# Altium project BLDC_Sch.PrjPcb
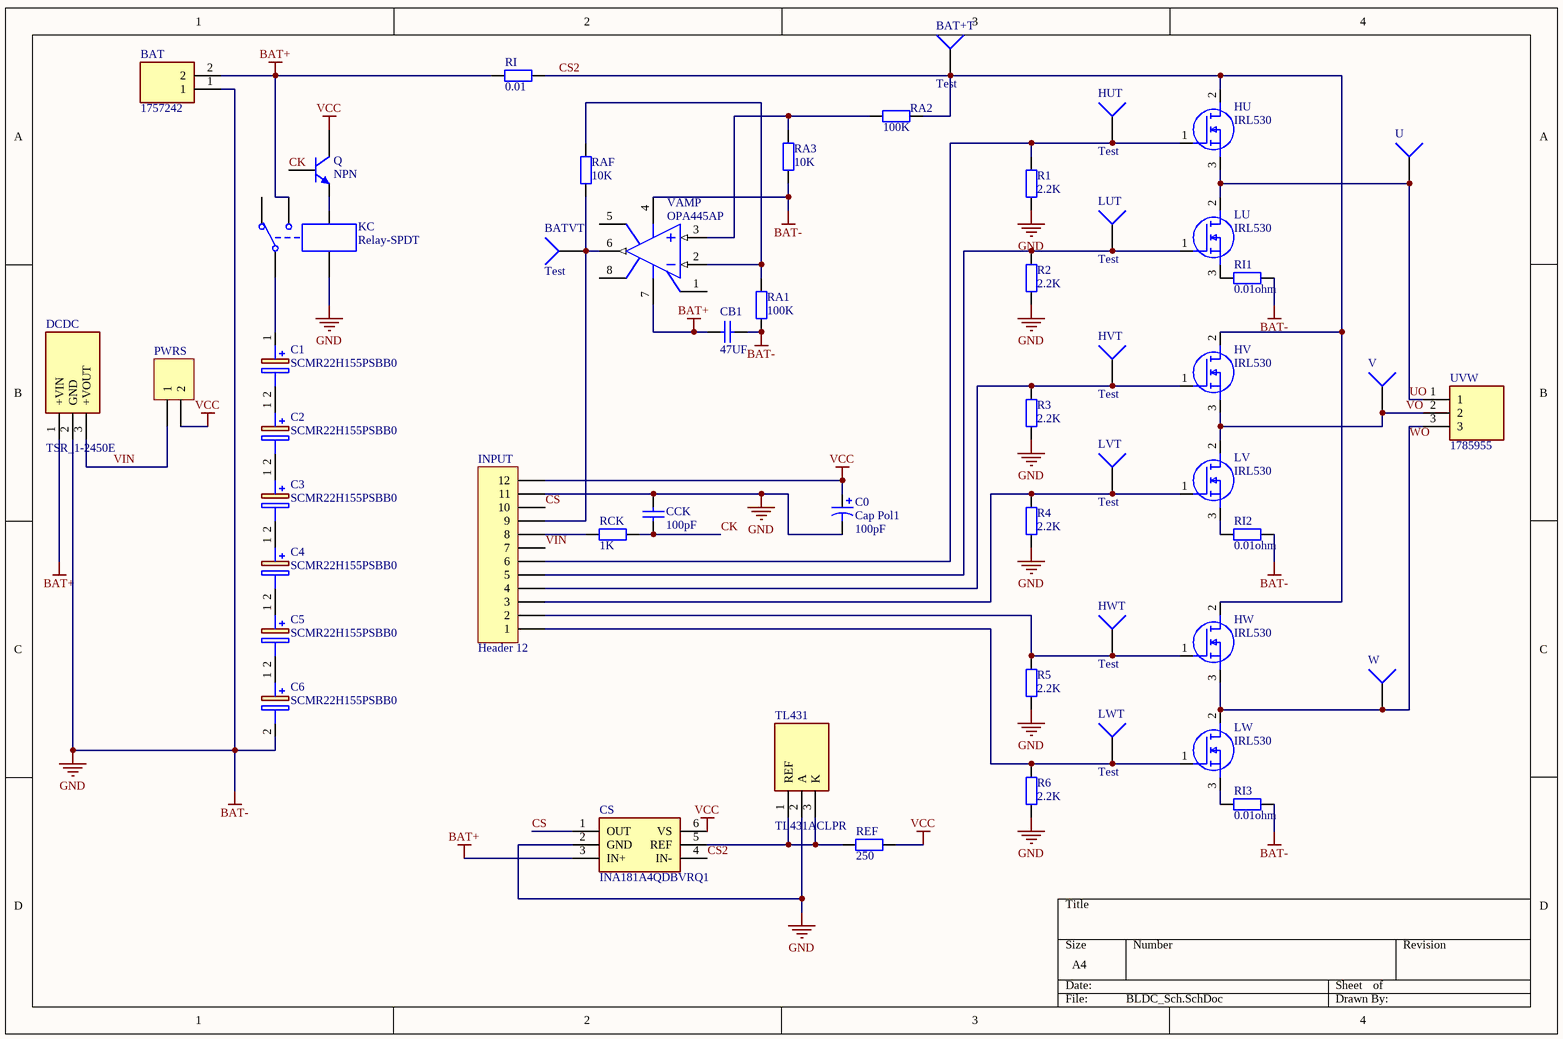
[diagram p0: BLDC_Sch.SchDoc]
1 sheet, 52 parts. Net scope: global (net labels, ports and power ports of the same name join across sheets).
Board files: BLDC_PCB.PcbDoc, BLDC_PCB_V2.PcbDoc, BLDC_PCB_V2.1.PcbDoc, BLDC_PCBV3.PcbDoc

## Sheet BLDC_Sch.SchDoc
size A4

### Parts
BAT  1757242  [SHDR2W100P0X508_1X2_1016X860X1250P]
BAT+T  Test  [PIN1]
BATVT  Test  [PIN1]
C0  Cap Pol1  value 100pF  [CAP 5.0*10*12.5]
C1  SCMR22H155PSBB0  [SCMR22H155PSBB0]
C2  SCMR22H155PSBB0  [SCMR22H155PSBB0]
C3  SCMR22H155PSBB0  [SCMR22H155PSBB0]
C4  SCMR22H155PSBB0  [SCMR22H155PSBB0]
C5  SCMR22H155PSBB0  [SCMR22H155PSBB0]
C6  SCMR22H155PSBB0  [SCMR22H155PSBB0]
CB1  value 47UF  [CBB 6.3*6.3*5]  (hidden comment: Cap)
CCK  value 100pF  [CBB 6.3*6.3*5]  (hidden comment: Cap)
CS  INA181A4QDBVRQ1  [SOT95P280X145-6N]
DCDC  TSR_1-2450E  [TSR12450E]
HU  IRL530  [TO254P465X1024X2050-3P]
HUT  Test  [PIN1]
HV  IRL530  [TO254P465X1024X2050-3P]
HVT  Test  [PIN1]
HW  IRL530  [TO254P465X1024X2050-3P]
HWT  Test  [PIN1]
INPUT  Header 12  [HDR1X12]
KC  Relay-SPDT  [SRD-C_BK]
LU  IRL530  [TO254P465X1024X2050-3P]
LUT  Test  [PIN1]
LV  IRL530  [TO254P465X1024X2050-3P]
LVT  Test  [PIN1]
LW  IRL530  [TO254P465X1024X2050-3P]
LWT  Test  [PIN1]
PWRS  Header 2  [HDR1X2]  (value not drawn)
Q  NPN  [TO-226-AA]
R1  value 2.2K  [RS 1/4W]  (hidden comment: Res2)
R2  value 2.2K  [RS 1/4W]  (hidden comment: Res2)
R3  value 2.2K  [RS 1/4W]  (hidden comment: Res2)
R4  value 2.2K  [RS 1/4W]  (hidden comment: Res2)
R5  value 2.2K  [RS 1/4W]  (hidden comment: Res2)
R6  value 2.2K  [RS 1/4W]  (hidden comment: Res2)
RA1  value 100K  [RS 1/4W]  (hidden comment: Res2)
RA2  value 100K  [RS 1/4W]  (hidden comment: Res2)
RA3  value 10K  [RS 1/4W]  (hidden comment: Res2)
RAF  value 10K  [RS 1/4W]  (hidden comment: Res2)
RCK  value 1K  [RS 1/4W]  (hidden comment: Res2)
REF  value 250  [RS 1/4W]  (hidden comment: Res2)
RI  value 0.01  [R 2512]  (hidden comment: Res2)
RI1  value 0.01ohm  [R 2512]  (hidden comment: Res2)
RI2  value 0.01ohm  [R 2512]  (hidden comment: Res2)
RI3  value 0.01ohm  [R 2512]  (hidden comment: Res2)
TL431  TL431ACLPR  [TL431ACLPR]
U  2376595-2  [23765952]  (value not drawn)
UVW  1785955  [SHDRRA3W103P0X508_1X3_1524X1200X872P]
V  2376595-2  [23765952]  (value not drawn)
VAMP  OPA445AP  [DIP794W53P254L959H508Q8N]
W  2376595-2  [23765952]  (value not drawn)

### Nets
BAT+: BAT.2 CB1.1 CS.3(IN+) DCDC.1(+VIN) KC.3 RI.1 VAMP.7(V+)
BAT-: BAT.1 C0.2 C6.2(-) CB1.2 CCK.2 CS.2(GND) DCDC.2(GND) INPUT.11 KC.4 R1.1 R2.1 R3.1 R4.2 R5.2 R6.2 RA1.2 RA3.1 RI1.2 RI2.2 RI3.2 TL431.2(A) VAMP.4(V-)  [also labelled GND]
VCC: C0.1 CS.6(VS) INPUT.12 PWRS.2 Q.1(C) REF.2
CK: CCK.1 Q.2(B) RCK.2
CS: CS.1(OUT) INPUT.10
CS2: BAT+T.1 CS.4(IN-) HU.2(D) HV.2(D) HW.2(D) RA2.2 RI.2
UO: HU.3(S) LU.2(D) U.1 UVW.1
VIN: DCDC.3(+VOUT) INPUT.7 PWRS.1
VO: HV.3(S) LV.2(D) UVW.2 V.1
WO: HW.3(S) LW.2(D) UVW.3 W.1
NetBATVT_1: BATVT.1 INPUT.9 RAF.1 VAMP.6(OUT)
NetC1_1: C1.1(+) KC.1
NetC1_2: C1.2(-) C2.1(+)
NetC2_2: C2.2(-) C3.1(+)
NetC3_2: C3.2(-) C4.1(+)
NetC4_2: C4.2(-) C5.1(+)
NetC5_2: C5.2(-) C6.1(+)
NetCS_5: CS.5(REF) REF.1 TL431.1(REF) TL431.3(K)
NetHU_1: HU.1(G) HUT.1 INPUT.6 R1.2
NetHV_1: HV.1(G) HVT.1 INPUT.4 R3.2
NetHW_1: HW.1(G) HWT.1 INPUT.2 R5.1
NetINPUT_1: INPUT.1 LW.1(G) LWT.1 R6.1
NetINPUT_3: INPUT.3 LV.1(G) LVT.1 R4.1
NetINPUT_5: INPUT.5 LU.1(G) LUT.1 R2.2
NetINPUT_8: INPUT.8 RCK.1
NetKC_5: KC.5 Q.3(E)
NetLU_3: LU.3(S) RI1.1
NetLV_3: LV.3(S) RI2.1
NetLW_3: LW.3(S) RI3.1
NetRA1_1: RA1.1 RAF.2 VAMP.2(IN-)
NetRA2_1: RA2.1 RA3.2 VAMP.3(IN+)

Not connected (* = marked no-connect by the designer): KC 2; VAMP 1(BAL1/CMPEN) 5(BAL2) 8(CMPEN)

### Library data of the parts
BAT = OQ025A000000G: Connector; Manufacturer_Name: Amphenol; Datasheet Link: https://media.digikey.com/pdf/Data%20Sheets/Amphenol%20PDFs/OQxx5A00xxxxG.pdf; Height: 12.5mm; Manufacturer_Part_Number: OQ025A000000G; Mouser Part Number: 523-OQ025A000000G; Mouser Price/Stock: https://www.mouser.co.uk/ProductDetail/Amphenol-Anytek/OQ025A000000G?qs=T3oQrply3y%2FPbDIhJzFZ1w%3D%3D
BAT+T BATVT HUT HVT HWT LUT LVT LWT U V W = Socket: LatestRevisionDate: 17-Jul-2002; LatestRevisionNote: Re-released for DXP Platform.; Publisher: Altium Limited
C0 = Cap Pol1: Polarized Capacitor (Radial); Published: 8-Jun-2000; LatestRevisionDate: 17-Jul-2002; LatestRevisionNote: Re-released for DXP Platform.; PackageReference: RB7.6-15; Publisher: Altium Limited; PackageDescription: Polarized Capacitor (Radial); 2 Leads
C1-C6 = SCMR22H155PSBB0: Capacitor Polarised; Manufacturer_Name: AVX; Datasheet Link: https://datasheets.avx.com/AVX-SCM.pdf; Height: 26mm; Manufacturer_Part_Number: SCMR22H155PSBB0; Mouser Part Number: 581-SCMR22H155PSBB0; Mouser Price/Stock: https://www.mouser.com/Search/Refine.aspx?Keyword=581-SCMR22H155PSBB0; Arrow Part Number: SCMR22H155PSBB0; Arrow Price/Stock: https://www.arrow.com/en/products/scmr22h155psbb0/avx
CB1 CCK = Cap: Capacitor; Published: 8-Jun-2000; LatestRevisionDate: 17-Jul-2002; LatestRevisionNote: Re-released for DXP Platform.; PackageReference: RAD-0.3; Publisher: Altium Limited; PackageDescription: Radial Cap, Thru-Hole; 2 Leads; 0.3 in Pin Spacing
CS = INA181A4QDBVRQ1: Integrated Circuit; Manufacturer_Name: Texas Instruments; Datasheet Link: http://www.ti.com/lit/gpn/INA181-Q1; Height: 1.45mm; Manufacturer_Part_Number: INA181A4QDBVRQ1; Mouser Part Number: 595-INA181A4QDBVRQ1; Mouser Price/Stock: https://www.mouser.co.uk/ProductDetail/Texas-Instruments/INA181A4QDBVRQ1?qs=9r4v7xj2Lnnq9cNkmpf%2FZg%3D%3D; Arrow Part Number: INA181A4QDBVRQ1; Arrow Price/Stock: https://www.arrow.com/en/products/ina181a4qdbvrq1/texas-instruments?region=nac
DCDC = TSR_1-2450E: Power Supply; Manufacturer_Name: Traco Power; Manufacturer_Part_Number: TSR 1-2450E; Datasheet Link: https://tracopower.com/tsr1e-datasheet/; Height: 10.6mm; Mouser Part Number: 495-TSR1-2450E; Mouser Price/Stock: https://www.mouser.co.uk/ProductDetail/TRACO-Power/TSR-1-2450E?qs=vmHwEFxEFR%2FlQnbAtEoeVA%3D%3D
HU HV HW LU LV LW = IRL530: MOSFET (N-Channel); Manufacturer_Name: Vishay; Datasheet Link: https://mouser.componentsearchengine.com/Datasheets/1/IRL530.pdf; Height: 4.65mm; Manufacturer_Part_Number: IRL530; Mouser Part Number: 844-IRL530; Mouser Price/Stock: https://www.mouser.co.uk/ProductDetail/Vishay-Siliconix/IRL530?qs=ehM%252BESVsXgxZiUd3tW%2FRCg%3D%3D
INPUT = Header 12: Header, 12-Pin; LatestRevisionDate: 17-Jul-2002; LatestRevisionNote: Re-released for DXP Platform.; Publisher: Altium Limited
KC = Relay-SPDT: Single-Pole Dual-Throw Relay; pin to pad: 1>4 2>5 4>2 5>1; Published: 24-Mar-1999; LatestRevisionDate: 17-Jul-2002; LatestRevisionNote: Re-released for DXP Platform.; PackageReference: MODULE5B; Publisher: Altium Limited
PWRS = Header 2: Header, 2-Pin; LatestRevisionDate: 17-Jul-2002; LatestRevisionNote: Re-released for DXP Platform.; Publisher: Altium Limited
Q = NPN: NPN Bipolar Transistor; Published: 8-Jun-2000; LatestRevisionDate: 17-Jul-2002; LatestRevisionNote: Re-released for DXP Platform.; PackageReference: TO-226-AA; Publisher: Altium Limited; PackageDescription: TO, Flat Index; 3 In-Line, Axial Leads; Body Dia. 4.8mm; Leads 0.55 x 0.51 mm (max); Code_JEDEC: TO-226-AA
R1-R6 RA1-RA3 RAF RCK REF RI RI1-RI3 = Res2: Resistor; Published: 8-Jun-2000; LatestRevisionDate: 17-Jul-2002; LatestRevisionNote: Re-released for DXP Platform.; PackageReference: AXIAL-0.4; Publisher: Altium Limited; PackageDescription: Axial Device, Thru-Hole; 2 Leads; 0.4 in Pin Spacing
TL431 = TL431ACLPR: Integrated Circuit; Manufacturer_Name: Texas Instruments; Datasheet Link: http://www.ti.com/lit/gpn/tl431; Height: 5.34mm; Manufacturer_Part_Number: TL431ACLPR; Mouser Part Number: 595-TL431ACLPR; Mouser Price/Stock: https://www.mouser.co.uk/ProductDetail/Texas-Instruments/TL431ACLPR?qs=0le1rQK8zxqBxlVXkAYIwg%3D%3D; Arrow Part Number: TL431ACLPR; Arrow Price/Stock: https://www.arrow.com/en/products/tl431aclpr/texas-instruments?region=nac
UVW = 1759020: Connector; Manufacturer_Name: Phoenix Contact; Datasheet Link: http://www.phoenixcontact.com/de/produkte/1759020/pdf; Height: 8.72mm; Manufacturer_Part_Number: 1759020; Mouser Part Number: 651-1759020; Mouser Price/Stock: https://www.mouser.co.uk/ProductDetail/Phoenix-Contact/1759020?qs=cyzODkzcbwBhDS9bIpwSxQ%3D%3D; Arrow Part Number: 1759020; Arrow Price/Stock: https://www.arrow.com/en/products/1759020/phoenix-contact
VAMP = LM101AJG: High Performance Operational Amplifier; ComponentAvailability: Obsolete; Published: 16-Jan-2001; LatestRevisionDate: 04-Mar-2005; LatestRevisionNote: Stylized 3D Model Added.; DatasheetVersion: Sep-1990; PackageVersion: Jan-1995; PackageReference: JG008; Publisher: Altium Limited; PackageDescription: DIP; 8 Leads; Row Spacing 7.62 mm; Pitch 2.54 mm; ComponentLink1Description: Manufacturer Link; ComponentLink1URL: http://www.ti.com/; ComponentLink2Description: Datasheet; ComponentLink2URL: http://focus.ti.com/lit/ds/slos061/slos061.pdf; ComponentLink3Description: Discontinuation Notice; ComponentLink3URL: http://focus.ti.com/pdfs/mltry/obsolete.pdf